# Altium schematic sheet NRF24L01.SchDoc
size A4; Organization: Altium Limited; Address1: L3, 12a Rodborough Rd; Address2: Frenchs Forest; Address3: NSW; Address4: Australia 2086
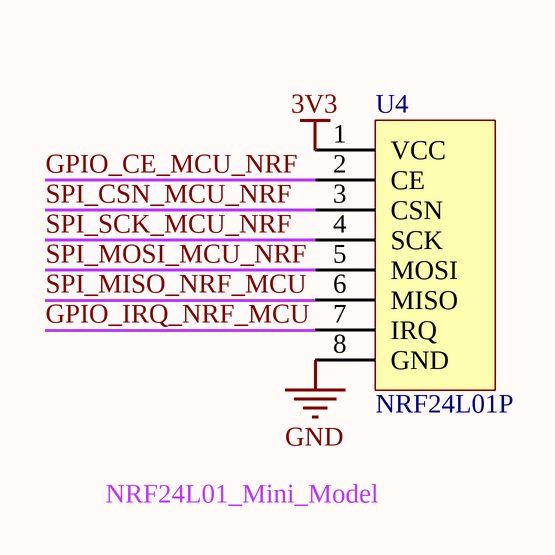
[diagram p0: NRF24L01.SchDoc]

## Parts
U4  NRF24L01P  [NRF24L01P]

## Nets
3V3: U4.1(VCC)
GND: U4.8(GND)
GPIO_CE_MCU_NRF: U4.2(CE)
GPIO_IRQ_NRF_MCU: U4.7(IRQ)
SPI_CSN_MCU_NRF: U4.3(CSN)
SPI_MISO_NRF_MCU: U4.6(MISO)
SPI_MOSI_MCU_NRF: U4.5(MOSI)
SPI_SCK_MCU_NRF: U4.4(SCK)

## Notes on the sheet
- NRF24L01_Mini_Model
- Title
- Size:
- Date:
- A4
- Number:
- Time:
- Revision:
- Sheet
- of
- File:

## Library data of the parts
U4 = NRF24L01P: 2.4G无线模块